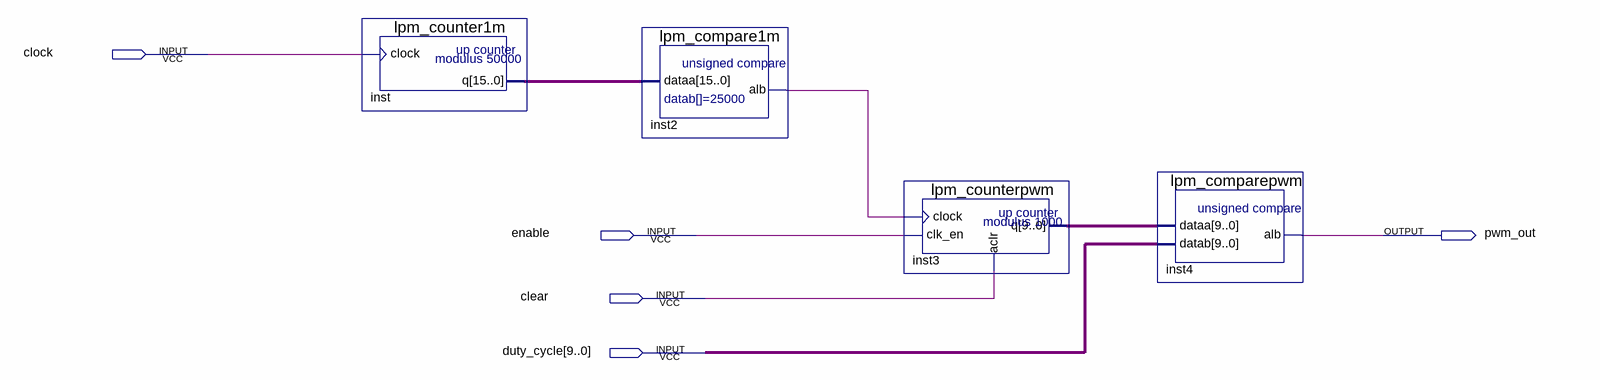
[diagram p0: schematic sheet]
// Quartus schematic pwm.bdf as structural Verilog: 4 symbols, 5 pins
module pwm (
  input  clock,
  input  enable,
  input  clear,
  input  [9:0] duty_cycle,
  output pwm_out
);

  wire inst2_alb;
  wire [9:0] inst3_q;
  wire [15:0] inst_q;

  lpm_counter1m inst (.clock(clock), .q(inst_q));
  lpm_compare1m inst2 (.dataa(inst_q), .alb(inst2_alb));
  lpm_counterpwm inst3 (.clock(inst2_alb), .clk_en(enable), .aclr(clear), .q(inst3_q));
  lpm_comparepwm inst4 (.dataa(inst3_q), .datab(duty_cycle), .alb(pwm_out));
endmodule
